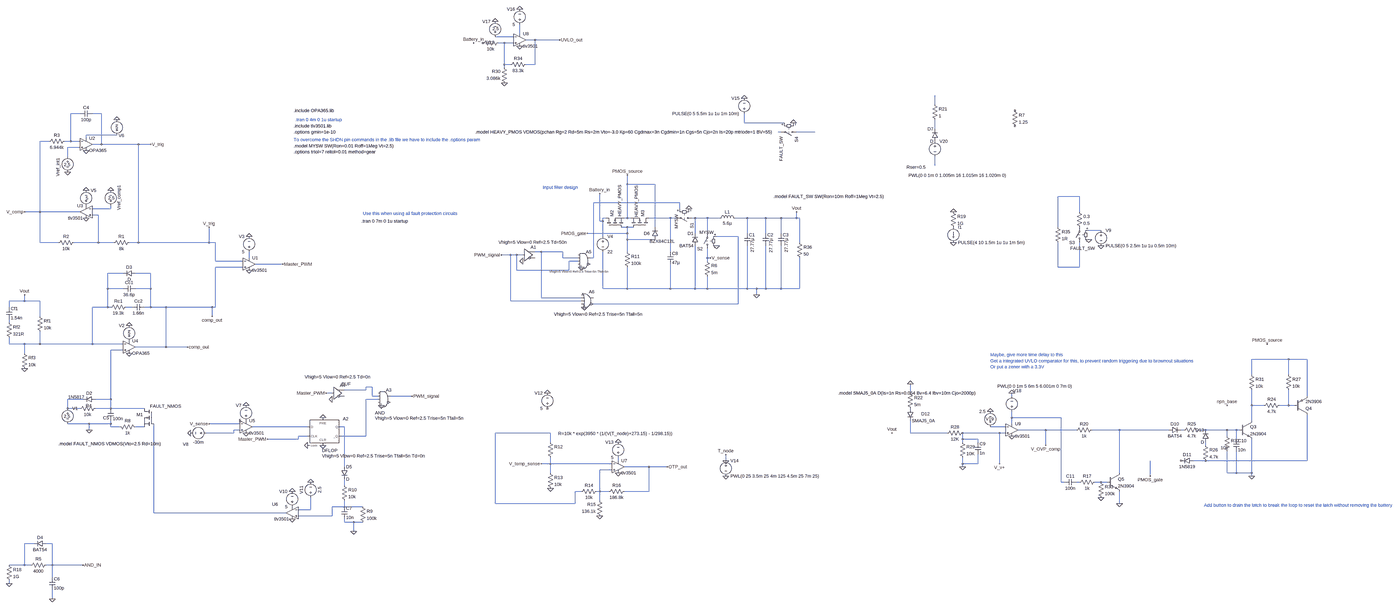
[diagram p0: schematic SCP_OCP.asc, whole sheet]
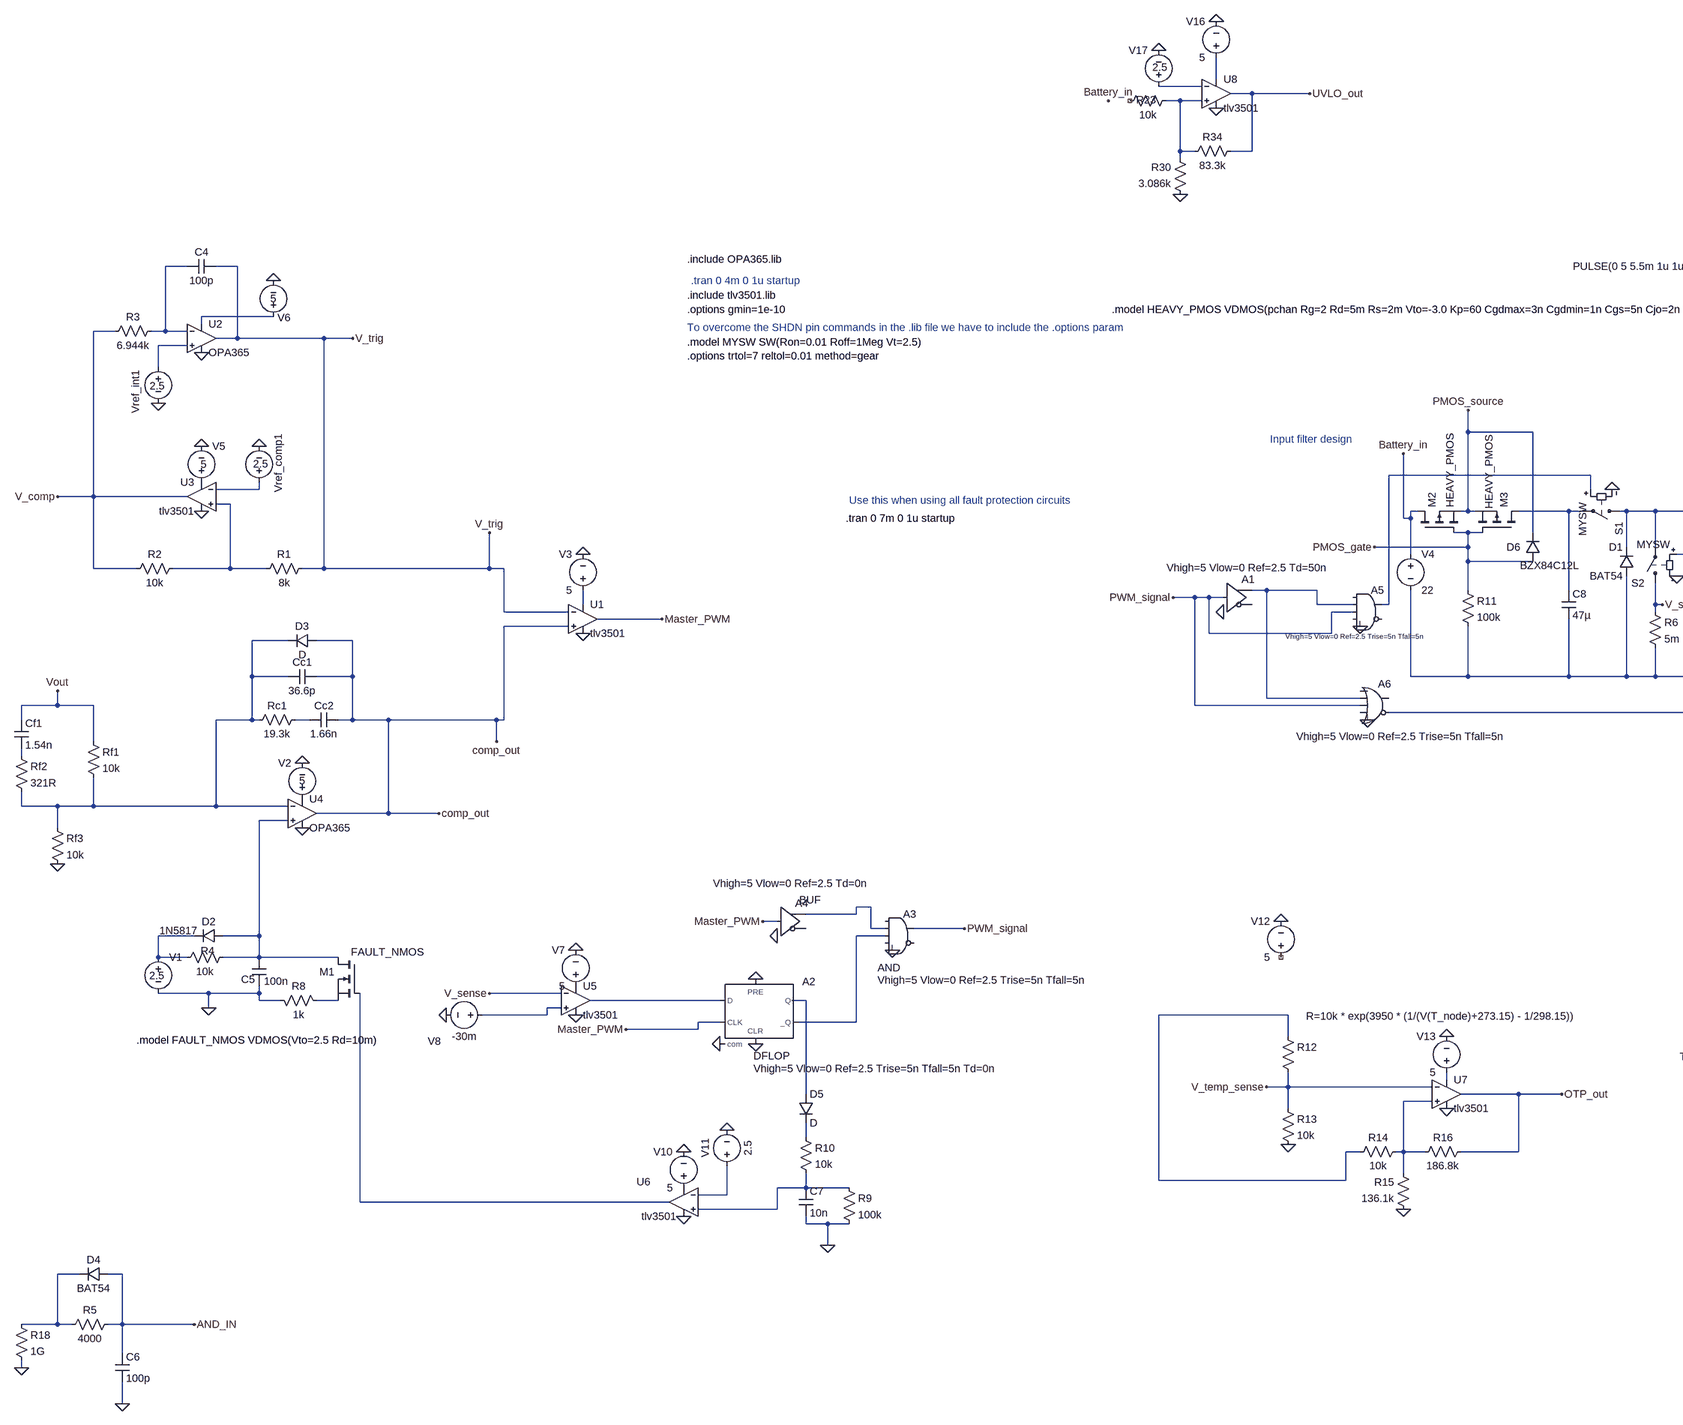
[diagram p1: schematic SCP_OCP.asc, part, row 1 of 1, column 1 of 2]
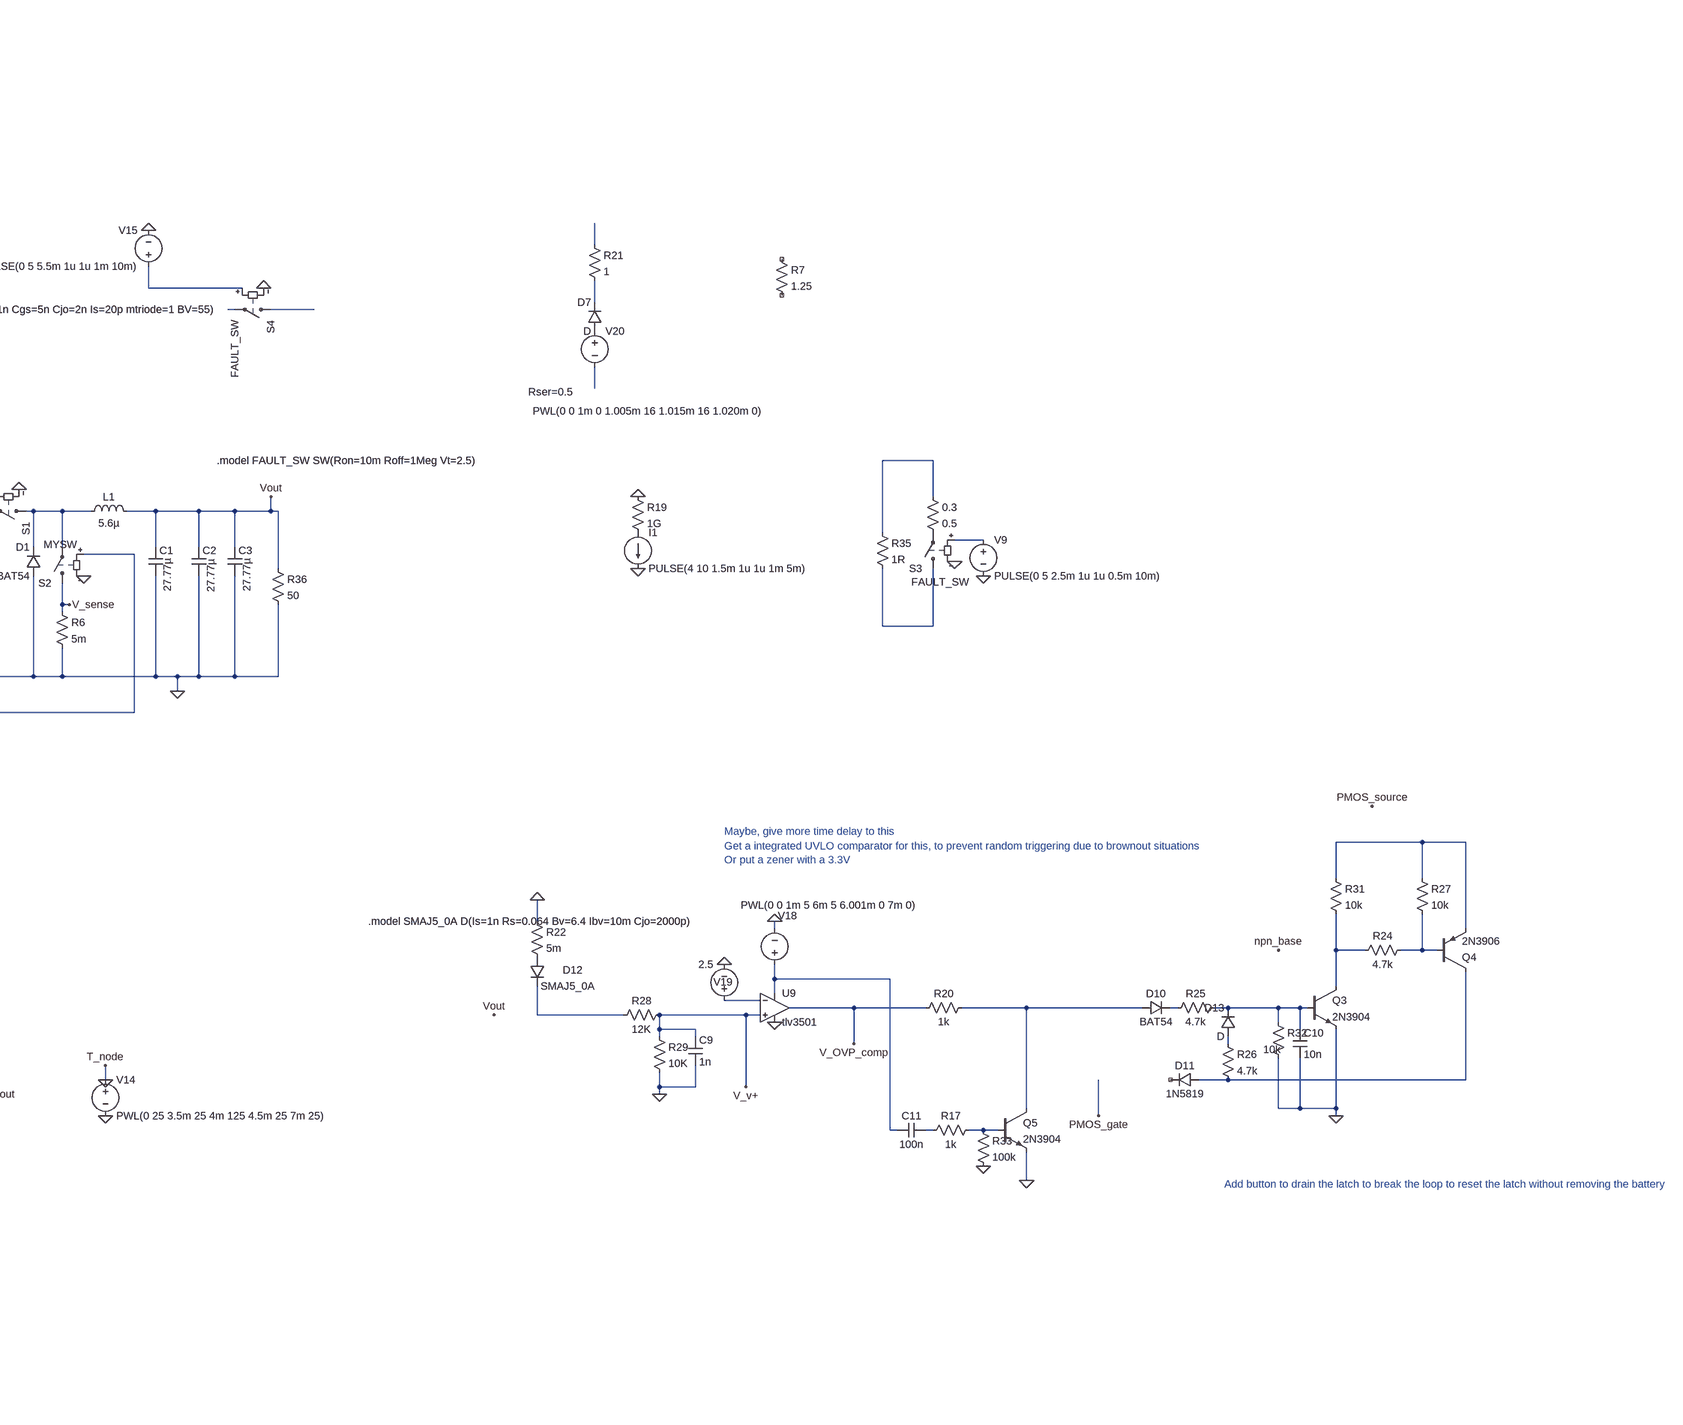
[diagram p2: schematic SCP_OCP.asc, part, row 1 of 1, column 2 of 2]
SCP_OCP.asc, the LTspice schematic file:
Version 4.1
SHEET 1 6228 2488
WIRE 1568 -976 1568 -1024
WIRE 1536 -960 1440 -960
WIRE 1648 -944 1600 -944
WIRE 1776 -944 1648 -944
WIRE 1488 -928 1456 -928
WIRE 1536 -928 1488 -928
WIRE 1488 -816 1488 -928
WIRE 1520 -816 1488 -816
WIRE 1648 -816 1648 -944
WIRE 1648 -816 1600 -816
WIRE 1488 -800 1488 -816
WIRE 3728 -608 3728 -656
WIRE -720 -560 -768 -560
WIRE -608 -560 -656 -560
WIRE 2736 -512 2736 -560
WIRE 2944 -512 2736 -512
WIRE 3728 -480 3728 -528
WIRE 2928 -464 2912 -464
WIRE 3104 -464 3008 -464
WIRE -528 -448 -688 -448
WIRE -688 -432 -688 -448
WIRE -880 -416 -928 -416
WIRE -768 -416 -768 -560
WIRE -768 -416 -800 -416
WIRE -720 -416 -768 -416
WIRE -608 -400 -608 -560
WIRE -608 -400 -656 -400
WIRE -416 -400 -608 -400
WIRE -352 -400 -416 -400
WIRE -720 -384 -784 -384
WIRE -784 -336 -784 -384
WIRE 3728 -288 3728 -336
WIRE 2128 -192 2128 -240
WIRE 2272 -192 2128 -192
WIRE 4480 -128 4368 -128
WIRE 2400 -96 1952 -96
WIRE -560 -64 -560 -80
WIRE -560 -64 -656 -64
WIRE 2400 -64 2400 -96
WIRE -928 -48 -928 -416
WIRE -928 -48 -1008 -48
WIRE -720 -48 -928 -48
WIRE 4480 -48 4480 -128
WIRE -624 -32 -656 -32
WIRE 2016 -16 2000 -16
WIRE 2128 -16 2128 -192
WIRE 2128 -16 2112 -16
WIRE 2144 -16 2128 -16
WIRE 2352 -16 2240 -16
WIRE 2384 -16 2352 -16
WIRE 2480 -16 2464 -16
WIRE 2544 -16 2480 -16
WIRE 2608 -16 2544 -16
WIRE 2752 -16 2688 -16
WIRE 2848 -16 2752 -16
WIRE 2928 -16 2848 -16
WIRE 3008 -16 3008 -48
WIRE 3008 -16 2928 -16
WIRE 3024 -16 3008 -16
WIRE 1984 0 1984 -144
WIRE 2000 0 2000 -16
WIRE 2000 0 1984 0
WIRE 2128 32 2096 32
WIRE 2160 32 2128 32
WIRE 2272 32 2272 -192
WIRE 4368 32 4368 -128
WIRE 4592 48 4528 48
WIRE 2128 64 2128 32
WIRE 2128 64 1920 64
WIRE 2480 64 2480 -16
WIRE 2544 64 2544 -16
WIRE 2752 64 2752 -16
WIRE 2848 64 2848 -16
WIRE 2928 64 2928 -16
WIRE 2000 80 2000 0
WIRE 2704 80 2592 80
WIRE 2128 96 2128 64
WIRE 2272 96 2128 96
WIRE -928 112 -928 -48
WIRE -832 112 -928 112
WIRE -624 112 -624 -32
WIRE -624 112 -752 112
WIRE -544 112 -624 112
WIRE -416 112 -416 -400
WIRE -416 112 -464 112
WIRE -48 112 -48 32
WIRE -48 112 -416 112
WIRE -16 112 -48 112
WIRE 3024 112 3024 -16
WIRE 1680 160 1648 160
WIRE 1792 160 1680 160
WIRE 2128 160 2128 96
WIRE 2352 160 2352 -16
WIRE 1520 176 1472 176
WIRE 1552 176 1520 176
WIRE 1584 176 1552 176
WIRE 160 192 160 160
WIRE 1792 192 1792 160
WIRE 1872 192 1792 192
WIRE 1952 192 1952 -96
WIRE 1952 192 1936 192
WIRE 2544 192 2544 144
WIRE 2560 192 2544 192
WIRE -16 208 -16 112
WIRE 128 208 -16 208
WIRE 1872 208 1824 208
WIRE 2544 208 2544 192
WIRE 336 224 192 224
WIRE 128 240 -16 240
WIRE 4368 240 4368 112
WIRE 4480 240 4480 112
WIRE 4480 240 4368 240
WIRE 1552 256 1552 176
WIRE 1824 256 1824 208
WIRE 1824 256 1552 256
WIRE -496 272 -576 272
WIRE -352 272 -432 272
WIRE -576 352 -576 272
WIRE -496 352 -576 352
WIRE -352 352 -352 272
WIRE -352 352 -432 352
WIRE 2000 352 2000 160
WIRE 2128 352 2128 240
WIRE 2128 352 2000 352
WIRE 2352 352 2352 224
WIRE 2352 352 2128 352
WIRE 2480 352 2480 128
WIRE 2480 352 2352 352
WIRE 2544 352 2544 288
WIRE 2544 352 2480 352
WIRE 2752 352 2752 128
WIRE 2752 352 2544 352
WIRE 2800 352 2752 352
WIRE 2848 352 2848 128
WIRE 2848 352 2800 352
WIRE 2928 352 2928 128
WIRE 2928 352 2848 352
WIRE 3024 352 3024 192
WIRE 3024 352 2928 352
WIRE 2800 384 2800 352
WIRE 1680 400 1680 160
WIRE 1888 400 1680 400
WIRE -1008 416 -1008 384
WIRE -1008 416 -1088 416
WIRE -928 416 -1008 416
WIRE 1520 416 1520 176
WIRE 1888 416 1520 416
WIRE 2704 432 2704 80
WIRE 2704 432 1952 432
WIRE -1088 448 -1088 416
WIRE -576 448 -576 352
WIRE -576 448 -656 448
WIRE -560 448 -576 448
WIRE -448 448 -480 448
WIRE -352 448 -352 352
WIRE -352 448 -384 448
WIRE -272 448 -352 448
WIRE -32 448 -272 448
WIRE -16 448 -16 240
WIRE -16 448 -32 448
WIRE -928 496 -928 416
WIRE -32 496 -32 448
WIRE -1088 528 -1088 512
WIRE -1088 640 -1088 608
WIRE -1008 640 -1088 640
WIRE -928 640 -928 576
WIRE -928 640 -1008 640
WIRE -656 640 -656 448
WIRE -656 640 -928 640
WIRE -496 640 -656 640
WIRE -272 656 -272 448
WIRE -272 656 -432 656
WIRE -160 656 -272 656
WIRE -496 672 -560 672
WIRE -1008 688 -1008 640
WIRE 5568 720 5376 720
WIRE 5664 720 5568 720
WIRE 5376 800 5376 720
WIRE 5568 800 5568 720
WIRE 800 864 768 864
WIRE 768 880 768 864
WIRE 768 880 656 880
WIRE 592 896 560 896
WIRE 3600 896 3600 848
WIRE 800 912 800 864
WIRE 832 912 800 912
WIRE 1008 912 896 912
WIRE 4128 912 4128 896
WIRE 5664 912 5664 720
WIRE -704 928 -784 928
WIRE -560 928 -560 672
WIRE -560 928 -640 928
WIRE 832 928 768 928
WIRE 5376 960 5376 880
WIRE 5440 960 5376 960
WIRE 5568 960 5568 880
WIRE 5568 960 5520 960
WIRE 5600 960 5568 960
WIRE -784 976 -784 928
WIRE -720 976 -784 976
WIRE -560 976 -560 928
WIRE -560 976 -640 976
WIRE -384 976 -560 976
WIRE 4128 1024 4128 992
WIRE 4384 1024 4128 1024
WIRE 5376 1040 5376 960
WIRE -672 1056 -784 1056
WIRE -560 1056 -560 1040
WIRE -560 1056 -672 1056
WIRE 112 1056 -48 1056
WIRE 4128 1056 4128 1024
WIRE -560 1072 -560 1056
WIRE -512 1072 -560 1072
WIRE -384 1072 -432 1072
WIRE 464 1072 176 1072
WIRE 656 1072 624 1072
WIRE 4096 1072 4016 1072
WIRE -672 1088 -672 1056
WIRE 112 1088 80 1088
WIRE 4304 1088 4160 1088
WIRE 4464 1088 4304 1088
WIRE 4688 1088 4544 1088
WIRE 4944 1088 4688 1088
WIRE 5024 1088 5008 1088
WIRE 5136 1088 5104 1088
WIRE 5248 1088 5136 1088
WIRE 5296 1088 5248 1088
WIRE 5312 1088 5296 1088
WIRE 80 1104 80 1088
WIRE 80 1104 -64 1104
WIRE 1728 1104 1440 1104
WIRE 3600 1104 3600 1040
WIRE 3792 1104 3600 1104
WIRE 4064 1104 3872 1104
WIRE 4096 1104 4064 1104
WIRE 464 1120 416 1120
WIRE 768 1120 768 928
WIRE 768 1120 640 1120
WIRE 5248 1120 5248 1088
WIRE 416 1136 416 1120
WIRE 416 1136 256 1136
WIRE 3872 1136 3872 1104
WIRE 3952 1136 3872 1136
WIRE 5296 1136 5296 1088
WIRE 1728 1152 1728 1104
WIRE 3872 1152 3872 1136
WIRE 3952 1152 3952 1136
WIRE 4304 1168 4304 1088
WIRE 5136 1168 5136 1152
WIRE 2080 1248 2080 1232
WIRE 2640 1248 2640 1216
WIRE 5136 1248 5072 1248
WIRE 5664 1248 5664 1008
WIRE 5664 1248 5136 1248
WIRE 1728 1264 1728 1232
WIRE 1728 1264 1680 1264
WIRE 2048 1264 1728 1264
WIRE 3872 1264 3872 1232
WIRE 3952 1264 3952 1216
WIRE 3952 1264 3872 1264
WIRE 4064 1264 4064 1104
WIRE 656 1280 656 1072
WIRE 2240 1280 2112 1280
WIRE 2336 1280 2240 1280
WIRE 3872 1280 3872 1264
WIRE 2048 1296 1984 1296
WIRE 1728 1312 1728 1264
WIRE 4688 1312 4688 1088
WIRE 5248 1312 5248 1200
WIRE 5296 1312 5296 1200
WIRE 5296 1312 5248 1312
WIRE 5376 1312 5376 1136
WIRE 5376 1312 5296 1312
WIRE 4848 1328 4848 1248
WIRE 5376 1328 5376 1312
WIRE 4384 1360 4384 1024
WIRE 4400 1360 4384 1360
WIRE 4480 1360 4464 1360
WIRE 4592 1360 4560 1360
WIRE 4624 1360 4592 1360
WIRE 656 1376 656 1344
WIRE 1888 1408 1856 1408
WIRE 1984 1408 1984 1296
WIRE 1984 1408 1968 1408
WIRE 2032 1408 1984 1408
WIRE 2240 1408 2240 1280
WIRE 2240 1408 2112 1408
WIRE 1984 1456 1984 1408
WIRE 1440 1472 1440 1104
WIRE 1856 1472 1856 1408
WIRE 1856 1472 1440 1472
WIRE 4688 1472 4688 1408
WIRE 656 1488 656 1456
WIRE 656 1488 592 1488
WIRE 752 1488 656 1488
WIRE 480 1504 480 1440
WIRE 480 1504 416 1504
WIRE -336 1520 -336 1056
WIRE 352 1520 -336 1520
WIRE 592 1536 592 1488
WIRE 592 1536 416 1536
WIRE 656 1568 656 1552
WIRE 704 1568 656 1568
WIRE 752 1568 704 1568
WIRE 704 1616 704 1568
WIRE -960 1680 -1008 1680
WIRE -864 1680 -896 1680
WIRE -1008 1792 -1008 1680
WIRE -1008 1792 -1088 1792
WIRE -976 1792 -1008 1792
WIRE -864 1792 -864 1680
WIRE -864 1792 -896 1792
WIRE -704 1792 -864 1792
WIRE -864 1856 -864 1792
WIRE -1088 1888 -1088 1872
WIRE -864 1968 -864 1920
FLAG 2800 384 0
FLAG -1008 768 0
FLAG -464 544 0
FLAG -464 688 0
FLAG -160 656 comp_out
FLAG 3008 -48 Vout
FLAG 160 256 0
FLAG -32 496 comp_out
FLAG 160 80 0
FLAG 2448 -64 0
FLAG -688 -160 0
FLAG -528 -528 0
FLAG -688 -16 0
FLAG -560 -160 0
FLAG -784 -256 0
FLAG -352 -400 V_trig
FLAG -1008 -48 V_comp
FLAG -688 -368 0
FLAG -48 32 V_trig
FLAG -1008 384 Vout
FLAG -672 1088 0
FLAG 2592 128 0
FLAG -864 1968 0
FLAG -704 1792 AND_IN
FLAG 2560 192 V_sense
FLAG -48 1056 V_sense
FLAG 336 224 Master_PWM
FLAG 560 896 Master_PWM
FLAG 256 1136 Master_PWM
FLAG 1008 912 PWM_signal
FLAG 144 960 0
FLAG 144 1104 0
FLAG -144 1104 0
FLAG 544 1024 0
FLAG 544 1168 0
FLAG 464 1168 0
FLAG 848 960 0
FLAG 4528 96 0
FLAG 4592 128 0
FLAG 704 1616 0
FLAG 384 1408 0
FLAG 384 1552 0
FLAG 480 1360 0
FLAG 592 928 0
FLAG 1584 208 0
FLAG 1888 240 0
FLAG 1904 448 0
FLAG 1472 176 PWM_signal
FLAG 1712 896 0
FLAG 1728 1392 0
FLAG 1680 1264 V_temp_sense
FLAG 2080 1152 0
FLAG 2080 1312 0
FLAG 1984 1536 0
FLAG 2640 1328 0
FLAG 2640 1216 T_node
FLAG 1920 64 PMOS_gate
FLAG 2128 -240 PMOS_source
FLAG 4128 896 0
FLAG 4128 1120 0
FLAG 5376 1328 0
FLAG 4016 992 0
FLAG 4064 1264 V_v+
FLAG 4304 1168 V_OVP_comp
FLAG 3872 1280 0
FLAG 4688 1472 0
FLAG 4592 1440 0
FLAG 5248 960 npn_base
FLAG 3504 1104 Vout
FLAG 5456 640 PMOS_source
FLAG 4848 1328 PMOS_gate
FLAG -1088 1888 0
FLAG 3824 112 0
FLAG 3824 -48 0
FLAG 2736 -640 0
FLAG 2992 -512 0
FLAG 3600 848 0
FLAG 1984 -144 Battery_in
FLAG 1568 -1104 0
FLAG 1568 -912 0
FLAG 1488 -720 0
FLAG 1328 -928 Battery_in
FLAG 1440 -1040 0
FLAG 2336 1280 OTP_out
FLAG 1776 -944 UVLO_out
FLAG 2640 1248 0
SYMBOL cap 2736 64 R0
WINDOW 3 42 24 VRight 2
SYMATTR Value 27.77µ
SYMATTR InstName C1
SYMATTR SpiceLine V=25 Rser=2.94m Lser=0.6n
SYMBOL ind 2592 0 R270
WINDOW 0 32 56 VTop 2
WINDOW 3 5 56 VBottom 2
SYMATTR InstName L1
SYMATTR Value 5.6µ
SYMATTR SpiceLine Rser=1m
SYMBOL voltage -784 960 R0
WINDOW 123 0 0 Left 0
WINDOW 39 0 0 Left 0
WINDOW 3 -20 57 Left 2
SYMATTR Value 2.5
SYMATTR InstName V1
SYMBOL res -944 480 R0
SYMATTR InstName Rf1
SYMATTR Value 10k
SYMBOL res -1104 512 R0
SYMATTR InstName Rf2
SYMATTR Value 321R
SYMBOL cap -1104 448 R0
SYMATTR InstName Cf1
SYMATTR Value 1.54n
SYMBOL res -464 432 R90
WINDOW 0 0 56 VBottom 2
WINDOW 3 32 56 VTop 2
SYMATTR InstName Rc1
SYMATTR Value 19.3k
SYMBOL cap -432 336 R90
WINDOW 0 0 32 VBottom 2
WINDOW 3 32 32 VTop 2
SYMATTR InstName Cc1
SYMATTR Value 36.6p
SYMBOL res -1024 672 R0
SYMATTR InstName Rf3
SYMATTR Value 10k
SYMBOL voltage -464 640 R180
WINDOW 0 24 96 Left 2
WINDOW 3 -7 57 Left 2
WINDOW 123 0 0 Left 0
WINDOW 39 0 0 Left 0
SYMATTR InstName V2
SYMATTR Value 5
SYMBOL cap -384 432 R90
WINDOW 0 0 32 VBottom 2
WINDOW 3 32 32 VTop 2
SYMATTR InstName Cc2
SYMATTR Value 1.66n
SYMBOL cap 2832 64 R0
WINDOW 3 43 26 VRight 2
SYMATTR Value 27.77µ
SYMATTR InstName C2
SYMATTR SpiceLine V=25 Rser=2.94m Lser=0.6n
SYMBOL cap 2912 64 R0
WINDOW 3 43 24 VRight 2
SYMATTR Value 27.77µ
SYMATTR InstName C3
SYMATTR SpiceLine V=25 Rser=2.94m Lser=0.6n
SYMBOL OpAmps\\opamp2 160 160 R0
SYMATTR InstName U1
SYMATTR Value tlv3501
SYMBOL voltage 160 176 R180
WINDOW 0 24 96 Left 2
WINDOW 3 24 16 Left 2
WINDOW 123 0 0 Left 0
WINDOW 39 0 0 Left 0
SYMATTR InstName V3
SYMATTR Value 5
SYMBOL sw 2480 -16 R90
WINDOW 3 -19 97 Left 2
SYMATTR Value MYSW
SYMATTR InstName S1
SYMBOL voltage 2000 64 R0
SYMATTR InstName V4
SYMATTR Value 22
SYMBOL voltage -688 -64 M180
WINDOW 0 24 96 Left 2
WINDOW 3 -2 56 Left 2
WINDOW 123 0 0 Left 0
WINDOW 39 0 0 Left 0
SYMATTR InstName V5
SYMATTR Value 5
SYMBOL voltage -528 -432 R180
WINDOW 0 -38 14 Left 2
WINDOW 3 -7 56 Left 2
WINDOW 123 0 0 Left 0
WINDOW 39 0 0 Left 0
SYMATTR InstName V6
SYMATTR Value 5
SYMBOL res -448 96 R90
WINDOW 0 0 56 VBottom 2
WINDOW 3 32 56 VTop 2
SYMATTR InstName R1
SYMATTR Value 8k
SYMBOL res -736 96 R90
WINDOW 0 0 56 VBottom 2
WINDOW 3 32 56 VTop 2
SYMATTR InstName R2
SYMATTR Value 10k
SYMBOL res -784 -432 R90
WINDOW 0 0 56 VBottom 2
WINDOW 3 32 56 VTop 2
SYMATTR InstName R3
SYMATTR Value 6.944k
SYMBOL cap -656 -576 R90
WINDOW 0 0 32 VBottom 2
WINDOW 3 32 32 VTop 2
SYMATTR InstName C4
SYMATTR Value 100p
SYMBOL voltage -560 -64 R180
WINDOW 0 -43 -7 VRight 2
WINDOW 3 -21 57 Left 2
WINDOW 123 0 0 Left 0
WINDOW 39 0 0 Left 0
SYMATTR InstName Vref_comp1
SYMATTR Value 2.5
SYMBOL voltage -784 -352 R0
WINDOW 0 -50 22 VRight 2
WINDOW 3 -19 58 Left 2
WINDOW 123 0 0 Left 0
WINDOW 39 0 0 Left 0
SYMATTR InstName Vref_int1
SYMATTR Value 2.5
SYMBOL OpAmps\\opamp2 -688 -464 R0
SYMATTR InstName U2
SYMATTR Value OPA365
SYMBOL OpAmps\\opamp2 -688 -112 M0
SYMATTR InstName U3
SYMATTR Value tlv3501
SYMBOL OpAmps\\opamp2 -464 592 R0
SYMATTR InstName U4
SYMATTR Value OPA365
SYMBOL res -624 960 R90
WINDOW 0 17 50 VBottom 2
WINDOW 3 32 56 VTop 2
SYMATTR InstName R4
SYMATTR Value 10k
SYMBOL cap -576 976 R0
WINDOW 0 -24 49 Left 2
WINDOW 3 27 53 Left 2
SYMATTR InstName C5
SYMATTR Value 100n
SYMBOL diode -640 912 R90
WINDOW 0 0 32 VBottom 2
WINDOW 3 -11 99 VTop 2
SYMATTR InstName D2
SYMATTR Value 1N5817
SYMBOL sw 2544 160 R180
WINDOW 3 -33 102 Left 2
SYMATTR Value MYSW
SYMATTR InstName S2
SYMBOL diode 2496 128 R180
WINDOW 0 24 64 Left 2
WINDOW 3 24 0 Left 2
SYMATTR InstName D1
SYMATTR Value BAT54
SYMBOL diode -432 256 R90
WINDOW 0 0 32 VBottom 2
WINDOW 3 32 32 VTop 2
SYMATTR InstName D3
SYMBOL res -880 1776 R90
WINDOW 0 0 56 VBottom 2
WINDOW 3 32 56 VTop 2
SYMATTR InstName R5
SYMATTR Value 4000
SYMBOL cap -880 1856 R0
SYMATTR InstName C6
SYMATTR Value 100p
SYMBOL diode -896 1664 R90
WINDOW 0 0 32 VBottom 2
WINDOW 3 32 32 VTop 2
SYMATTR InstName D4
SYMATTR Value BAT54
SYMBOL res 2528 192 R0
SYMATTR InstName R6
SYMATTR Value 5m
SYMBOL OpAmps\\opamp2 144 1008 R0
SYMATTR InstName U5
SYMATTR Value tlv3501
SYMBOL Digital\\dflop 544 1024 R0
WINDOW 3 -5 171 Left 2
WINDOW 123 -5 199 Left 2
SYMATTR Value DFLOP
SYMATTR Value2 Vhigh=5 Vlow=0 Ref=2.5 Trise=5n Tfall=5n Td=0n
SYMATTR InstName A2
SYMATTR SpiceModel ""
SYMBOL Digital\\and 864 864 R0
WINDOW 3 -49 135 Left 2
WINDOW 123 -49 163 Left 2
SYMATTR Value AND
SYMATTR Value2 Vhigh=5 Vlow=0 Ref=2.5 Trise=5n Tfall=5n
SYMATTR InstName A3
SYMATTR SpiceModel ""
SYMBOL voltage 144 1056 R180
WINDOW 0 24 96 Left 2
WINDOW 3 24 16 Left 2
WINDOW 123 0 0 Left 0
WINDOW 39 0 0 Left 0
SYMATTR InstName V7
SYMATTR Value 5
SYMBOL voltage -48 1104 R90
WINDOW 0 74 122 VBottom 2
WINDOW 3 32 56 VTop 2
WINDOW 123 0 0 Left 0
WINDOW 39 0 0 Left 0
SYMATTR InstName V8
SYMATTR Value -30m
SYMBOL current 3824 32 R0
WINDOW 123 0 0 Left 0
WINDOW 39 0 0 Left 0
SYMATTR InstName I1
SYMATTR Value PULSE(4 10 1.5m 1u 1u 1m 5m)
SYMBOL res 4128 -592 R0
SYMATTR InstName R7
SYMATTR Value 1.25
SYMBOL sw 4480 128 R180
WINDOW 3 -80 -14 Left 2
SYMATTR Value FAULT_SW
SYMATTR InstName S3
SYMBOL res 4464 -64 R0
SYMATTR InstName 0.3
SYMATTR Value 0.5
SYMBOL voltage 4592 32 R0
SYMATTR InstName V9
SYMATTR Value PULSE(0 5 2.5m 1u 1u 0.5m 10m)
SYMBOL nmos -336 976 M0
WINDOW 3 -142 -12 Left 2
SYMATTR Value FAULT_NMOS
SYMATTR InstName M1
SYMBOL res -416 1088 M270
WINDOW 0 32 56 VTop 2
WINDOW 3 0 56 VBottom 2
SYMATTR InstName R8
SYMATTR Value 1k
SYMBOL cap 640 1488 R0
SYMATTR InstName C7
SYMATTR Value 10n
SYMBOL res 736 1472 R0
SYMATTR InstName R9
SYMATTR Value 100k
SYMBOL diode 640 1280 R0
SYMATTR InstName D5
SYMBOL res 640 1360 R0
SYMATTR InstName R10
SYMATTR Value 10k
SYMBOL OpAmps\\opamp2 384 1456 M0
WINDOW 0 74 19 Left 2
SYMATTR InstName U6
SYMATTR Value tlv3501
SYMBOL voltage 384 1504 R180
WINDOW 0 24 96 Left 2
WINDOW 3 24 16 Left 2
WINDOW 123 0 0 Left 0
WINDOW 39 0 0 Left 0
SYMATTR InstName V10
SYMATTR Value 5
SYMBOL voltage 480 1456 M180
WINDOW 0 -32 56 VBottom 2
WINDOW 3 32 56 VTop 2
WINDOW 123 0 0 Left 0
WINDOW 39 0 0 Left 0
SYMATTR InstName V11
SYMATTR Value 2.5
SYMBOL Digital\\buf 592 832 R0
WINDOW 3 49 16 Left 2
WINDOW 123 -143 -20 Left 2
SYMATTR Value BUF
SYMATTR Value2 Vhigh=5 Vlow=0 Ref=2.5 Td=0n
SYMATTR InstName A4
SYMATTR SpiceModel ""
SYMBOL Digital\\buf 1584 112 R0
WINDOW 3 -126 -2 Left 2
SYMATTR Value Vhigh=5 Vlow=0 Ref=2.5 Td=50n
SYMATTR InstName A1
SYMBOL Digital\\and 1904 144 R0
WINDOW 3 -182 119 Left 1
SYMATTR Value Vhigh=5 Vlow=0 Ref=2.5 Trise=5n Tfall=5n
SYMATTR InstName A5
SYMBOL Digital\\or 1920 352 R0
WINDOW 3 -174 133 Left 2
SYMATTR Value Vhigh=5 Vlow=0 Ref=2.5 Trise=5n Tfall=5n
SYMATTR InstName A6
SYMBOL pmos 2016 32 R270
SYMATTR InstName M2
SYMATTR Value HEAVY_PMOS
SYMBOL res 2112 144 R0
SYMATTR InstName R11
SYMATTR Value 100k
SYMBOL diode 2288 96 R180
WINDOW 0 44 32 Left 2
WINDOW 3 -87 -9 Left 2
SYMATTR InstName D6
SYMATTR Value BZX84C12L
SYMBOL res 1712 1136 R0
WINDOW 3 56 -29 Left 2
SYMATTR Value R=10k * exp(3950 * (1/(V(T_node)+273.15) - 1/298.15))
SYMATTR InstName R12
SYMBOL res 1712 1296 R0
SYMATTR InstName R13
SYMATTR Value 10k
SYMBOL voltage 1712 992 R180
WINDOW 0 24 96 Left 2
WINDOW 3 24 16 Left 2
WINDOW 123 0 0 Left 0
WINDOW 39 0 0 Left 0
SYMATTR InstName V12
SYMATTR Value 5
SYMBOL OpAmps\\opamp2 2080 1216 R0
SYMATTR InstName U7
SYMATTR Value tlv3501
SYMBOL voltage 2080 1248 R180
WINDOW 0 24 96 Left 2
WINDOW 3 24 16 Left 2
WINDOW 123 0 0 Left 0
WINDOW 39 0 0 Left 0
SYMATTR InstName V13
SYMATTR Value 5
SYMBOL res 1984 1392 R90
WINDOW 0 0 56 VBottom 2
WINDOW 3 32 56 VTop 2
SYMATTR InstName R14
SYMATTR Value 10k
SYMBOL res 2000 1552 R180
WINDOW 0 36 76 Left 2
WINDOW 3 36 40 Left 2
SYMATTR InstName R15
SYMATTR Value 136.1k
SYMBOL res 2128 1392 R90
WINDOW 0 0 56 VBottom 2
WINDOW 3 32 56 VTop 2
SYMATTR InstName R16
SYMATTR Value 186.8k
SYMBOL voltage 2640 1232 R0
SYMATTR InstName V14
SYMATTR Value PWL(0 25 3.5m 25 4m 125 4.5m 25 7m 25)
SYMBOL OpAmps\\opamp2 4128 1024 R0
SYMATTR InstName U9
SYMATTR Value tlv3501
SYMBOL voltage 4128 1008 R180
WINDOW 0 -50 125 Left 2
WINDOW 3 -317 148 Left 2
SYMATTR InstName V18
SYMATTR Value PWL(0 0 1m 5 6m 5 6.001m 0 7m 0)
SYMBOL voltage 4016 1088 R180
WINDOW 0 -19 57 Left 2
WINDOW 123 0 0 Left 0
WINDOW 39 0 0 Left 0
SYMATTR InstName V19
SYMATTR Value 2.5
SYMBOL npn 5312 1040 R0
SYMATTR InstName Q3
SYMATTR Value 2N3904
SYMBOL pnp 5600 1008 M180
SYMATTR InstName Q4
SYMATTR Value 2N3906
SYMBOL res 5536 944 R90
WINDOW 0 0 56 VBottom 2
WINDOW 3 32 56 VTop 2
SYMATTR InstName R24
SYMATTR Value 4.7k
SYMBOL res 5120 1072 R90
WINDOW 0 0 56 VBottom 2
WINDOW 3 32 56 VTop 2
SYMATTR InstName R25
SYMATTR Value 4.7k
SYMBOL diode 4944 1104 R270
WINDOW 0 32 32 VTop 2
WINDOW 3 0 32 VBottom 2
SYMATTR InstName D10
SYMATTR Value BAT54
SYMBOL res 5120 1152 R0
SYMATTR InstName R26
SYMATTR Value 4.7k
SYMBOL diode 5072 1232 R90
WINDOW 0 0 32 VBottom 2
WINDOW 3 32 32 VTop 2
SYMATTR InstName D11
SYMATTR Value 1N5819
SYMBOL res 5552 784 R0
SYMATTR InstName R27
SYMATTR Value 10k
SYMBOL diode 3584 976 R0
WINDOW 0 73 28 Left 2
SYMATTR InstName D12
SYMATTR Value SMAJ5_0A
SYMBOL voltage 3728 -432 R0
WINDOW 3 -138 194 Left 2
WINDOW 39 -148 151 Left 2
SYMATTR Value PWL(0 0 1m 0 1.005m 16 1.015m 16 1.020m 0)
SYMATTR SpiceLine Rser=0.5
SYMATTR InstName V20
SYMBOL res 3888 1088 R90
WINDOW 0 0 56 VBottom 2
WINDOW 3 32 56 VTop 2
SYMATTR InstName R28
SYMATTR Value 12K
SYMBOL res 3856 1136 R0
SYMATTR InstName R29
SYMATTR Value 10K
SYMBOL cap 3936 1152 R0
SYMATTR InstName C9
SYMATTR Value 1n
SYMBOL cap 5280 1136 R0
SYMATTR InstName C10
SYMATTR Value 10n
SYMBOL res 5360 784 R0
SYMATTR InstName R31
SYMATTR Value 10k
SYMBOL diode 5152 1152 R180
WINDOW 0 24 64 Left 2
WINDOW 3 24 0 Left 2
SYMATTR InstName D13
SYMBOL res 5232 1104 R0
WINDOW 3 -18 77 Left 2
SYMATTR Value 10k
SYMATTR InstName R32
SYMBOL npn 4624 1312 R0
SYMATTR InstName Q5
SYMATTR Value 2N3904
SYMBOL cap 4464 1344 R90
WINDOW 0 0 32 VBottom 2
WINDOW 3 32 32 VTop 2
SYMATTR InstName C11
SYMATTR Value 100n
SYMATTR SpiceLine Rser=0.1
SYMBOL res 4576 1344 R0
SYMATTR InstName R33
SYMATTR Value 100k
SYMBOL res 4576 1344 R90
WINDOW 0 0 56 VBottom 2
WINDOW 3 32 56 VTop 2
SYMATTR InstName R17
SYMATTR Value 1k
SYMBOL res -1104 1776 R0
SYMATTR InstName R18
SYMATTR Value 1G
SYMBOL res 3808 -64 R0
SYMATTR InstName R19
SYMATTR Value 1G
SYMBOL res 4560 1072 R90
WINDOW 0 0 56 VBottom 2
WINDOW 3 32 56 VTop 2
SYMATTR InstName R20
SYMATTR Value 1k
SYMBOL diode 3744 -416 R180
WINDOW 0 24 64 Left 2
WINDOW 3 24 0 Left 2
SYMATTR InstName D7
SYMBOL res 3712 -624 R0
SYMATTR InstName R21
SYMATTR Value 1
SYMBOL voltage 2736 -544 R180
WINDOW 0 24 96 Left 2
WINDOW 3 24 16 Left 2
SYMATTR InstName V15
SYMATTR Value PULSE(0 5 5.5m 1u 1u 1m 10m)
SYMBOL sw 3024 -464 R90
SYMATTR InstName S4
SYMATTR Value FAULT_SW
SYMBOL pmos 2240 32 M270
WINDOW 3 53 65 Left 2
SYMATTR Value HEAVY_PMOS
SYMATTR InstName M3
SYMBOL res 3584 880 R0
SYMATTR InstName R22
SYMATTR Value 5m
SYMBOL cap 2336 160 R0
SYMATTR InstName C8
SYMATTR Value 47µ
SYMATTR SpiceLine Rser=0.05
SYMBOL OpAmps\\opamp2 1568 -1008 R0
SYMATTR InstName U8
SYMATTR Value tlv3501
SYMBOL voltage 1568 -1008 R180
WINDOW 0 24 96 Left 2
WINDOW 3 24 16 Left 2
WINDOW 123 0 0 Left 0
WINDOW 39 0 0 Left 0
SYMATTR InstName V16
SYMATTR Value 5
SYMBOL res 1472 -944 R90
WINDOW 0 30 60 VBottom 2
WINDOW 3 32 56 VTop 2
SYMATTR InstName R23
SYMATTR Value 10k
SYMBOL res 1504 -704 R180
WINDOW 0 36 76 Left 2
WINDOW 3 36 40 Left 2
SYMATTR InstName R30
SYMATTR Value 3.086k
SYMBOL res 1504 -800 R270
WINDOW 0 32 56 VTop 2
WINDOW 3 0 56 VBottom 2
SYMATTR InstName R34
SYMATTR Value 83.3k
SYMBOL voltage 1440 -944 R180
WINDOW 0 24 96 Left 2
WINDOW 3 -20 58 Left 2
WINDOW 123 0 0 Left 0
WINDOW 39 0 0 Left 0
SYMATTR InstName V17
SYMATTR Value 2.5
SYMBOL res 4352 16 R0
SYMATTR InstName R35
SYMATTR Value 1R
SYMBOL res 3008 96 R0
SYMATTR InstName R36
SYMATTR Value 50
TEXT 392 -392 Left 2 !.model MYSW SW(Ron=0.01 Roff=1Meg Vt=2.5)\n.options trtol=7 reltol=0.01 method=gear
TEXT 392 -576 Left 2 !.include OPA365.lib
TEXT 392 -496 Left 2 !.include tlv3501.lib
TEXT 744 0 Left 2 !.tran 0 7m 0 1u startup
TEXT 392 -464 Left 2 !.options gmin=1e-10
TEXT 392 -424 Left 2 ;To overcome the SHDN pin commands in the .lib file we have to include the .options param
TEXT 2888 -128 Left 2 !.model FAULT_SW SW(Ron=10m Roff=1Meg Vt=2.5)
TEXT -832 1160 Left 2 !.model FAULT_NMOS VDMOS(Vto=2.5 Rd=10m)
TEXT 3224 896 Left 2 !.model SMAJ5_0A D(Is=1n Rs=0.064 Bv=6.4 Ibv=10m Cjo=2000p)
TEXT 5128 1480 Left 2 ;Add button to drain the latch to break the loop to reset the latch without removing the battery
TEXT 4016 728 Left 2 ;Get a integrated UVLO comparator for this, to prevent random triggering due to brownout situations\nOr put a zener with a 3.3V
TEXT 1336 -464 Left 2 !.model HEAVY_PMOS VDMOS(pchan Rg=2 Rd=5m Rs=2m Vto=-3.0 Kp=60 Cgdmax=3n Cgdmin=1n Cgs=5n Cjo=2n Is=20p mtriode=1 BV=55)
TEXT 4016 696 Left 2 ;Maybe, give more time delay to this
TEXT 1688 -176 Left 2 ;Input filter design
TEXT 752 -40 Left 2 ;Use this when using all fault protection circuits
TEXT 400 -528 Left 2 ;.tran 0 4m 0 1u startup

The netlist it stands for:
* SCP_OCP.asc
C1 Vout 0 27.77µ V=25 Rser=2.94m Lser=0.6n
L1 N018 Vout 5.6µ Rser=1m
V1 N030 0 2.5
Rf1 Vout N024 10k
Rf2 N026 N024 321R
Cf1 Vout N026 1.54n
Rc1 N025 N024 19.3k
Cc1 comp_out N024 36.6p
Rf3 N024 0 10k
V2 P001 0 5
Cc2 comp_out N025 1.66n
C2 Vout 0 27.77µ V=25 Rser=2.94m Lser=0.6n
C3 Vout 0 27.77µ V=25 Rser=2.94m Lser=0.6n
X§U1 comp_out V_trig N022 0 Master_PWM tlv3501  ; pins In+ In- V+ V- OUT
V3 N022 0 5
S1 N018 N017 N014 0 MYSW
V4 Battery_in 0 22
V5 P002 0 5
V6 N010 0 5
R1 V_trig N016 8k
R2 N016 V_comp 10k
R3 N005 V_comp 6.944k
C4 V_trig N005 100p
Vref_comp1 N015 0 2.5
Vref_int1 N011 0 2.5
X§U2 N011 N005 N010 0 V_trig OPA365  ; pins In+ In- V+ V- OUT
X§U3 N016 N015 P002 0 V_comp tlv3501  ; pins In+ In- V+ V- OUT
X§U4 N027 N024 P001 0 comp_out OPA365  ; pins In+ In- V+ V- OUT
R4 N027 N030 10k
C5 N027 0 100n
D2 N027 N030 1N5817
S2 V_sense N018 N020 0 MYSW
D1 0 N018 BAT54
D3 comp_out N024 D
R5 AND_IN N055 4000
C6 AND_IN 0 100p
D4 AND_IN N055 BAT54
R6 V_sense 0 5m
X§U5 N039 V_sense P003 0 N036 tlv3501  ; pins In+ In- V+ V- OUT
A2 N036 0 Master_PWM 0 0 N031 N037 0 DFLOP Vhigh=5 Vlow=0 Ref=2.5 Trise=5n Tfall=5n Td=0n
A3 0 N029 N031 0 0 0 PWM_signal 0 AND Vhigh=5 Vlow=0 Ref=2.5 Trise=5n Tfall=5n
V7 P003 0 5
V8 N039 0 -30m
I1 P004 0 PULSE(4 10 1.5m 1u 1u 1m 5m)
R7 NC_01 NC_02 1.25
S3 N023 P005 N019 0 FAULT_SW
R§0.3 N013 P005 0.5
V9 N019 0 PULSE(0 5 2.5m 1u 1u 0.5m 10m)
M1 N027 N054 N035 N035 FAULT_NMOS
R8 N035 0 1k
C7 N052 0 10n
R9 N052 0 100k
D5 N037 N051 D
R10 N051 N052 10k
X§U6 N052 N053 P006 0 N054 tlv3501  ; pins In+ In- V+ V- OUT
V10 P006 0 5
V11 N053 0 2.5
A4 Master_PWM 0 0 0 0 0 N029 0 BUF Vhigh=5 Vlow=0 Ref=2.5 Td=0n
A1 PWM_signal 0 0 0 0 0 N021 0 BUF Vhigh=5 Vlow=0 Ref=2.5 Td=50n
A5 0 N021 PWM_signal 0 0 0 N014 0 AND Vhigh=5 Vlow=0 Ref=2.5 Trise=5n Tfall=5n
A6 0 N021 PWM_signal 0 0 N020 0 0 OR Vhigh=5 Vlow=0 Ref=2.5 Trise=5n Tfall=5n
M2 Battery_in PMOS_gate PMOS_source PMOS_source HEAVY_PMOS
R11 PMOS_gate 0 100k
D6 PMOS_gate PMOS_source BZX84C12L
R12 N043 V_temp_sense R=10k * exp(3950 * (1/(V(T_node)+273.15) - 1/298.15))
R13 V_temp_sense 0 10k
V12 NC_03 0 5
X§U7 N048 V_temp_sense N046 0 OTP_out tlv3501  ; pins In+ In- V+ V- OUT
V13 N046 0 5
R14 N048 N043 10k
R15 0 N048 136.1k
R16 OTP_out N048 186.8k
V14 0 0 PWL(0 25 3.5m 25 4m 125 4.5m 25 7m 25)
X§U9 V_v+ N038 N034 0 V_OVP_comp tlv3501  ; pins In+ In- V+ V- OUT
V18 N034 0 PWL(0 0 1m 5 6m 5 6.001m 0 7m 0)
V19 N038 0 2.5
Q3 N032 N042 0 0 2N3904
Q4 N047 N033 N028 0 2N3906
R24 N033 N032 4.7k
R25 N042 N041 4.7k
D10 N040 N041 BAT54
R26 N045 N047 4.7k
D11 N047 NC_04 1N5819
R27 N028 N033 10k
D12 P007 N044 SMAJ5_0A
V20 P008 N012 PWL(0 0 1m 0 1.005m 16 1.015m 16 1.020m 0) Rser=0.5
R28 V_v+ N044 12K
R29 V_v+ 0 10K
C9 V_v+ 0 1n
C10 N042 0 10n
R31 N028 N032 10k
D13 N045 N042 D
R32 N042 0 10k
Q5 N040 N050 0 0 2N3904
C11 N049 N034 100n Rser=0.1
R33 N050 0 100k
R17 N050 N049 1k
R18 N055 0 1G
R19 0 P004 1G
R20 N040 V_OVP_comp 1k
D7 P008 N007 D
R21 N004 N007 1
V15 N006 0 PULSE(0 5 5.5m 1u 1u 1m 10m)
S4 N009 N008 N006 0 FAULT_SW
M3 N017 PMOS_gate PMOS_source PMOS_source HEAVY_PMOS
R22 0 P007 5m
C8 N017 0 47µ Rser=0.05
X§U8 N003 N002 N001 0 UVLO_out tlv3501  ; pins In+ In- V+ V- OUT
V16 N001 0 5
R23 N003 NC_05 10k
R30 0 N003 3.086k
R34 N003 UVLO_out 83.3k
V17 N002 0 2.5
R35 N013 N023 1R
R36 Vout 0 50
.model D D
.lib standard.dio
.model NPN NPN
.model PNP PNP
.lib standard.bjt
.model NMOS NMOS
.model PMOS PMOS
.lib standard.mos
.model MYSW SW(Ron=0.01 Roff=1Meg Vt=2.5)
.options trtol=7 reltol=0.01 method=gear
.include OPA365.lib
.include tlv3501.lib
.tran 0 7m 0 1u startup
.options gmin=1e-10
* To overcome the SHDN pin commands in the .lib file we have to include the .options param
.model FAULT_SW SW(Ron=10m Roff=1Meg Vt=2.5)
.model FAULT_NMOS VDMOS(Vto=2.5 Rd=10m)
.model SMAJ5_0A D(Is=1n Rs=0.064 Bv=6.4 Ibv=10m Cjo=2000p)
* Add button to drain the latch to break the loop to reset the latch without removing the battery
* Get a integrated UVLO comparator for this, to prevent random triggering due to brownout situations
* Or put a zener with a 3.3V
.model HEAVY_PMOS VDMOS(pchan Rg=2 Rd=5m Rs=2m Vto=-3.0 Kp=60 Cgdmax=3n Cgdmin=1n Cgs=5n Cjo=2n Is=20p mtriode=1 BV=55)
* Maybe, give more time delay to this
* Input filter design
* Use this when using all fault protection circuits
* .tran 0 4m 0 1u startup
.backanno
.end